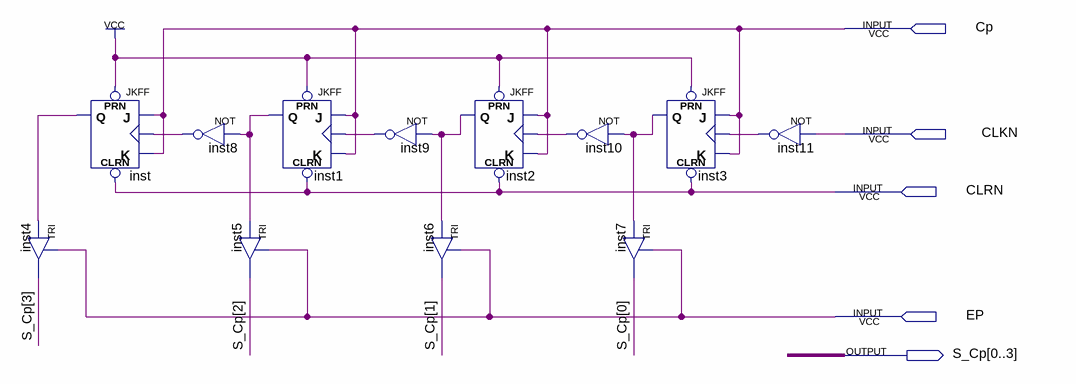
[diagram p0: schematic sheet]
// Quartus schematic Contador_de_Programa.bdf as structural Verilog: 12 symbols, 5 pins
module Contador_de_Programa (
  input  Cp,
  input  CLKN,
  input  CLRN,
  input  EP,
  output [0:3] S_Cp
);

  wire inst1_q, inst2_q, inst3_q, inst8_out, inst9_out, inst10_out, inst11_out, inst_q;

  TRI inst4 (.IN(inst_q), .OE(EP), .OUT(S_Cp[3]));
  JKFF inst (.PRN(1'b1), .CLRN(CLRN), .K(Cp), .J(Cp), .CLK(inst8_out), .Q(inst_q));
  not inst8 (inst8_out, inst1_q);
  TRI inst5 (.IN(inst1_q), .OE(EP), .OUT(S_Cp[2]));
  JKFF inst1 (.PRN(1'b1), .CLRN(CLRN), .K(Cp), .J(Cp), .CLK(inst9_out), .Q(inst1_q));
  not inst9 (inst9_out, inst2_q);
  JKFF inst2 (.PRN(1'b1), .CLRN(CLRN), .K(Cp), .J(Cp), .CLK(inst10_out), .Q(inst2_q));
  TRI inst6 (.IN(inst2_q), .OE(EP), .OUT(S_Cp[1]));
  not inst10 (inst10_out, inst3_q);
  TRI inst7 (.IN(inst3_q), .OE(EP), .OUT(S_Cp[0]));
  JKFF inst3 (.PRN(1'b1), .CLRN(CLRN), .K(Cp), .J(Cp), .CLK(inst11_out), .Q(inst3_q));
  not inst11 (inst11_out, CLKN);
endmodule
